# EAGLE design eagle_mini (EAGLE 7.2.0)
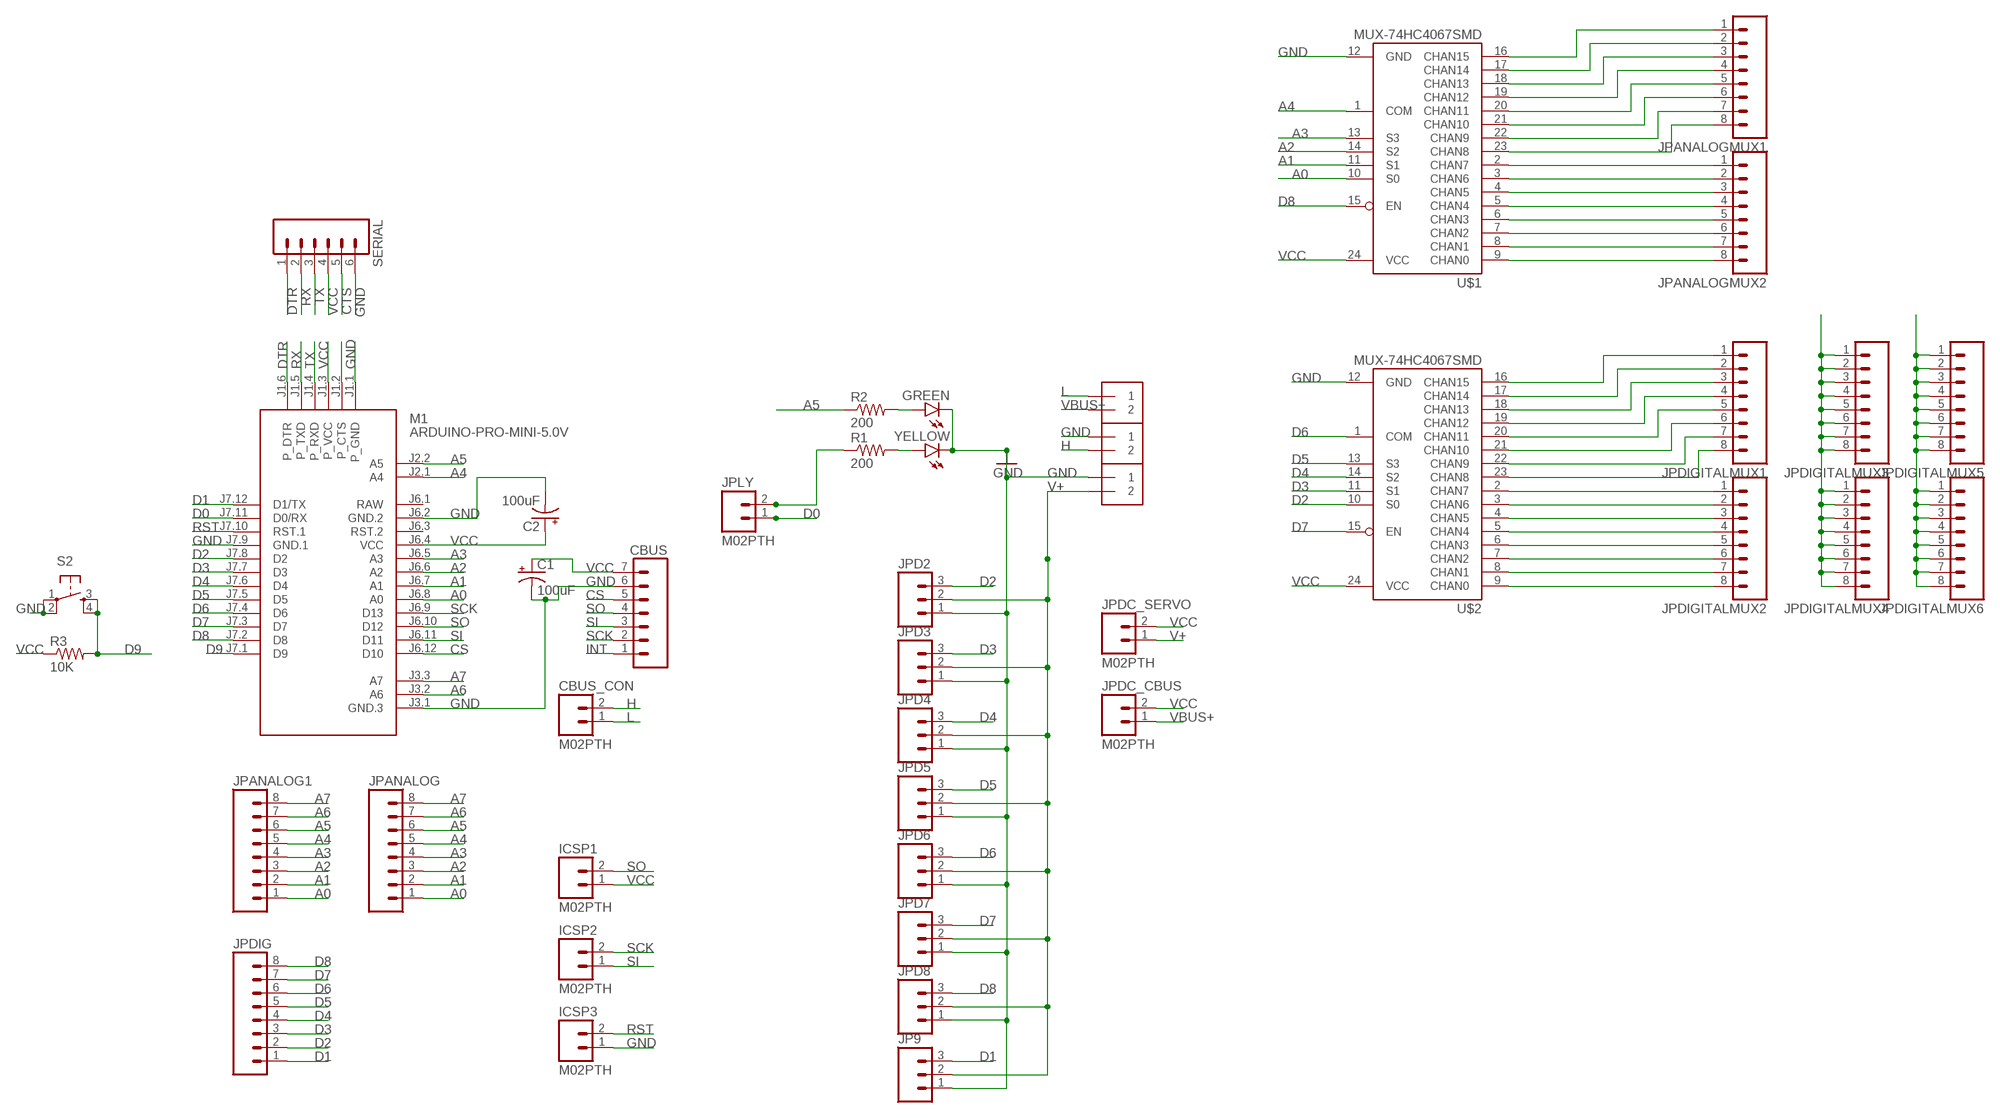
[diagram p0: schematic, sheet 1]

## Parts
C1  100uF  CPOL-USE2.5-6  [E2,5-6]
C2  100uF  CPOL-USE2.5-6  [E2,5-6]
CBUS  M07  [1X07]
CBUS_CON  M02PTH  [1X02]
EXT_VCC  1X2-3.5MM  [1X2-3.5MM]
GREEN  LED-3MM-NO_SILK  [LED3MM-NS]
ICSP1  M02PTH  [1X02]
ICSP2  M02PTH  [1X02]
ICSP3  M02PTH  [1X02]
J1  1X2-3.5MM  [1X2-3.5MM]
J2  1X2-3.5MM  [1X2-3.5MM]
JP9  M03PTH  [1X03]
JPANALOG  M08  [1X08_ROUND]
JPANALOG1  M08  [1X08_ROUND]
JPANALOGMUX1  M08  [1X08_ROUND]
JPANALOGMUX2  M08  [1X08_ROUND]
JPD2  M03PTH  [1X03]
JPD3  M03PTH  [1X03]
JPD4  M03PTH  [1X03]
JPD5  M03PTH  [1X03]
JPD6  M03PTH  [1X03]
JPD7  M03PTH  [1X03]
JPD8  M03PTH  [1X03]
JPDC_CBUS  M02PTH  [1X02]
JPDC_SERVO  M02PTH  [1X02]
JPDIG  M08  [1X08_ROUND]
JPDIGITALMUX1  M08  [1X08_ROUND]
JPDIGITALMUX2  M08  [1X08_ROUND]
JPDIGITALMUX3  M08  [1X08_ROUND]
JPDIGITALMUX4  M08  [1X08_ROUND]
JPDIGITALMUX5  M08  [1X08_ROUND]
JPDIGITALMUX6  M08  [1X08_ROUND]
JPLY  M02PTH  [1X02]
M1  ARDUINO-PRO-MINI-5.0V  [ARDUINO-PRO-MINI]
R1  200  RESISTORAXIAL-0.3  [AXIAL-0.3]
R2  200  RESISTORAXIAL-0.3  [AXIAL-0.3]
R3  10K  RESISTORAXIAL-0.3  [AXIAL-0.3]
S2  TAC_SWITCHPTH  [TACTILE-PTH]
SERIAL  M06SILK_FEMALE_PTH  [1X06]
U$1  MUX-74HC4067SMD  [SSOP24]
U$2  MUX-74HC4067SMD  [SSOP24]
YELLOW  LED-3MM-NO_SILK  [LED3MM-NS]

## Nets
6: JPDIGITALMUX2.2 U$2.3(CHAN6)
A0: JPANALOG1.1 JPANALOG.1 M1.J6.8(A0) U$1.10(S0)
A1: JPANALOG1.2 JPANALOG.2 M1.J6.7(A1) U$1.11(S1)
A2: JPANALOG1.3 JPANALOG.3 M1.J6.6(A2) U$1.14(S2)
A3: JPANALOG1.4 JPANALOG.4 M1.J6.5(A3) U$1.13(S3)
A4: JPANALOG1.5 JPANALOG.5 M1.J2.1(A4) U$1.1(COM)
A5: JPANALOG1.6 JPANALOG.6 M1.J2.2(A5) R2.P$1
A6: JPANALOG1.7 JPANALOG.7 M1.J3.2(A6)
A7: JPANALOG1.8 JPANALOG.8 M1.J3.3(A7)
CS: CBUS.5 M1.J6.12(D10)
CTS: SERIAL.5
D0: JPLY.1 M1.J7.11(D0/RX)
D1: JP9.3 JPDIG.1 M1.J7.12(D1/TX)
D2: JPD2.3 JPDIG.2 M1.J7.8(D2) U$2.10(S0)
D3: JPD3.3 JPDIG.3 M1.J7.7(D3) U$2.11(S1)
D4: JPD4.3 JPDIG.4 M1.J7.6(D4) U$2.14(S2)
D5: JPD5.3 JPDIG.5 M1.J7.5(D5) U$2.13(S3)
D6: JPD6.3 JPDIG.6 M1.J7.4(D6) U$2.1(COM)
D7: JPD7.3 JPDIG.7 M1.J7.3(D7) U$2.15(EN)
D8: JPD8.3 JPDIG.8 M1.J7.2(D8) U$1.15(EN)
D9: M1.J7.1(D9) R3.P$2 S2.3 S2.4
DTR: M1.J1.6(P_DTR) SERIAL.1
GND: C1.- C2.- CBUS.6 EXT_VCC.1 GREEN.K(C) ICSP3.1 J1.1 JP9.1 JPD2.1 JPD3.1 JPD4.1 JPD5.1 JPD6.1 JPD7.1 JPD8.1 JPDIGITALMUX3.1 JPDIGITALMUX3.2 JPDIGITALMUX3.3 JPDIGITALMUX3.4 JPDIGITALMUX3.5 JPDIGITALMUX3.6 JPDIGITALMUX3.7 JPDIGITALMUX3.8 JPDIGITALMUX4.1 JPDIGITALMUX4.2 JPDIGITALMUX4.3 JPDIGITALMUX4.4 JPDIGITALMUX4.5 JPDIGITALMUX4.6 JPDIGITALMUX4.7 JPDIGITALMUX4.8 M1.J1.1(P_GND) M1.J3.1(GND.3) M1.J6.2(GND.2) M1.J7.9(GND.1) S2.1 S2.2 SERIAL.6 U$1.12(GND) U$2.12(GND) YELLOW.K(C)
H: CBUS_CON.2 J1.2
INT: CBUS.1
L: CBUS_CON.1 J2.1
MA0: JPANALOGMUX2.8 U$1.9(CHAN0)
MA1: JPANALOGMUX2.7 U$1.8(CHAN1)
MA2: JPANALOGMUX2.6 U$1.7(CHAN2)
MA3: JPANALOGMUX2.5 U$1.6(CHAN3)
MA4: JPANALOGMUX2.4 U$1.5(CHAN4)
MA5: JPANALOGMUX2.3 U$1.4(CHAN5)
MA6: JPANALOGMUX2.2 U$1.3(CHAN6)
MA7: JPANALOGMUX2.1 U$1.2(CHAN7)
MA8: JPANALOGMUX1.8 U$1.23(CHAN8)
MA9: JPANALOGMUX1.7 U$1.22(CHAN9)
MA10: JPANALOGMUX1.6 U$1.21(CHAN10)
MA11: JPANALOGMUX1.5 U$1.20(CHAN11)
MA12: JPANALOGMUX1.4 U$1.19(CHAN12)
MA13: JPANALOGMUX1.3 U$1.18(CHAN13)
MA14: JPANALOGMUX1.2 U$1.17(CHAN14)
MA15: JPANALOGMUX1.1 U$1.16(CHAN15)
MD0: JPDIGITALMUX2.8 U$2.9(CHAN0)
MD1: JPDIGITALMUX2.7 U$2.8(CHAN1)
MD2: JPDIGITALMUX2.6 U$2.7(CHAN2)
MD3: JPDIGITALMUX2.5 U$2.6(CHAN3)
MD4: JPDIGITALMUX2.4 U$2.5(CHAN4)
MD5: JPDIGITALMUX2.3 U$2.4(CHAN5)
MD7: JPDIGITALMUX2.1 U$2.2(CHAN7)
MD8: JPDIGITALMUX1.8 U$2.23(CHAN8)
MD9: JPDIGITALMUX1.7 U$2.22(CHAN9)
MD10: JPDIGITALMUX1.6 U$2.21(CHAN10)
MD11: JPDIGITALMUX1.5 U$2.20(CHAN11)
MD12: JPDIGITALMUX1.4 U$2.19(CHAN12)
MD13: JPDIGITALMUX1.3 U$2.18(CHAN13)
MD14: JPDIGITALMUX1.2 U$2.17(CHAN14)
MD15: JPDIGITALMUX1.1 U$2.16(CHAN15)
N$6: M1.J1.2(P_CTS)
N$17: GREEN.A R2.P$2
N$18: R1.P$2 YELLOW.A
N$28: JPLY.2 R1.P$1
RST: ICSP3.2 M1.J7.10(RST.1)
RX: M1.J1.5(P_TXD) SERIAL.2
SCK: CBUS.2 ICSP2.2 M1.J6.9(D13)
SI: CBUS.3 ICSP2.1 M1.J6.11(D11)
SO: CBUS.4 ICSP1.2 M1.J6.10(D12)
TX: M1.J1.4(P_RXD) SERIAL.3
V+: EXT_VCC.2 JP9.2 JPD2.2 JPD3.2 JPD4.2 JPD5.2 JPD6.2 JPD7.2 JPD8.2 JPDC_SERVO.1 JPDIGITALMUX5.1 JPDIGITALMUX5.2 JPDIGITALMUX5.3 JPDIGITALMUX5.4 JPDIGITALMUX5.5 JPDIGITALMUX5.6 JPDIGITALMUX5.7 JPDIGITALMUX5.8 JPDIGITALMUX6.1 JPDIGITALMUX6.2 JPDIGITALMUX6.3 JPDIGITALMUX6.4 JPDIGITALMUX6.5 JPDIGITALMUX6.6 JPDIGITALMUX6.7 JPDIGITALMUX6.8
VBUS+: J2.2 JPDC_CBUS.1
VCC: C1.+ C2.+ CBUS.7 ICSP1.1 JPDC_CBUS.2 JPDC_SERVO.2 M1.J1.3(P_VCC) M1.J6.4(VCC) R3.P$1 SERIAL.4 U$1.24(VCC) U$2.24(VCC)
Unconnected: M1.J6.3(RST.2)

## Power pins joined to a net without a drawn wire
RAW: M1.J6.1(RAW)

## Library data of the parts
C1 C2 = adafruit:CPOL-US: POLARIZED CAPACITOR, American symbol
CBUS = SparkFun-Connectors:M07: Header 7 Standard 7-pin 0.1" header. Use with straight break away headers (SKU : PRT-00116), right angle break away headers (PRT-00553), swiss pins (PRT-00743), machine pins (PRT-00117), and female headers (PRT-00115). NOTES ON THE VARIANTS LOCK and LOCK_LONGPADS... This footprint was designed to help hold the alignment of a through-hole component (i.e. 7-pin header) while soldering it into place. You may notice that each hole has been shifted either up or down by 0.005 of an inch from it's more standard position (which is usually a perfectly straight line). This slight alteration caused the pins (the squares in the middle) to touch the edges of the holes. Because they are alternating, it causes a "brace" to hold the header in place. 0.005 has proven to be the perfect amount of "off-center" position when using our standard breakaway headers. Although looks a little odd when you look at the bare footprint, once you have a header in there, the alteration is very hard to notice. Also, if you push a header all the way into place, it is covered up entirely on the bottom side. This idea of altering the position of holes to aid alignment will be further integrated into the Sparkfun Library for other footprints. It can help hold any component with 3 or more connection pins.
CBUS_CON ICSP1-ICSP3 JPDC_CBUS JPDC_SERVO JPLY = SparkFun-Connectors:M02: Standard 2-pin 0.1" header. Use with - straight break away headers ( PRT-00116) - right angle break away headers (PRT-00553) - swiss pins (PRT-00743) - machine pins (PRT-00117) - female headers (PRT-00115) Molex polarized connector foot print use with: PRT-08233 with associated crimp pins and housings. 2.54_SCREWTERM for use with PRT-10571. 3.5mm Screw Terminal footprints for PRT-08084 5mm Screw Terminal footprints for use with PRT-08432
EXT_VCC J1 J2 = Arduino_merg:1X2: 3.5mm Terminal block http://www.ladyada.net/library/pcb/eaglelibrary.html
GREEN YELLOW = SparkFun-LED:LED: LEDs Standard schematic elements and footprints for 5mm, 3mm, 1206, and 0603 sized LEDs. 5mm - Spark Fun Electronics SKU : COM-00529 (and others)
JP9 JPD2-JPD8 = SparkFun-Connectors:M03: Header 3 Standard 3-pin 0.1" header. Use with straight break away headers (SKU : PRT-00116), right angle break away headers (PRT-00553), swiss pins (PRT-00743), machine pins (PRT-00117), and female headers (PRT-00115). Molex polarized connector foot print use with SKU : PRT-08232 with associated crimp pins and housings.
JPANALOG JPANALOG1 JPANALOGMUX1 JPANALOGMUX2 JPDIG JPDIGITALMUX1-JPDIGITALMUX6 = SparkFun-Connectors:M08: Header 8 Standard 8-pin 0.1" header. Use with straight break away headers (SKU : PRT-00116), right angle break away headers (PRT-00553), swiss pins (PRT-00743), machine pins (PRT-00117), and female headers (PRT-00115).
M1 = diy-modules:ARDUINO-PRO-MINI-*: Arduino Pro Mini
R1-R3 = SparkFun-Passives:RESISTOR: Resistor Basic schematic elements and footprints for 0603, 1206, and PTH resistors.
S2 = SparkFun-Retired:TAC_SWITCH: Momentary Switch Button commonly used for reset or general input. Spark Fun Electronics SKU : COM-00097 SMT- SWCH-08247
SERIAL = SparkFun-Connectors:M06: Header 6 Standard 6-pin 0.1" header. Use with straight break away headers (SKU : PRT-00116), right angle break away headers (PRT-00553), swiss pins (PRT-00743), machine pins (PRT-00117), and female headers (PRT-00115). Molex polarized connector foot print use with SKU : PRT-08094 with associated crimp pins and housings. NOTES ON THE VARIANTS LOCK and LOCK_LONGPADS... This footprint was designed to help hold the alignment of a through-hole component (i.e. 6-pin header) while soldering it into place. You may notice that each hole has been shifted either up or down by 0.005 of an inch from it's more standard position (which is a perfectly straight line). This slight alteration caused the pins (the squares in the middle) to touch the edges of the holes. Because they are alternating, it causes a "brace" to hold the component in place. 0.005 has proven to be the perfect amount of "off-center" position when using our standard breakaway headers. Although looks a little odd when you look at the bare footprint, once you have a header in there, the alteration is very hard to notice. Also,if you push a header all the way into place, it is covered up entirely on the bottom side. This idea of altering the position of holes to aid alignment will be further integrated into the Sparkfun Library for other footprints. It can help hold any component with 3 or more connection pins.; PROD_ID: CONN-08437
U$1 U$2 = SparkFun-AnalogIC:MUX-74HC4067: 16-channel analog MUX

## Board
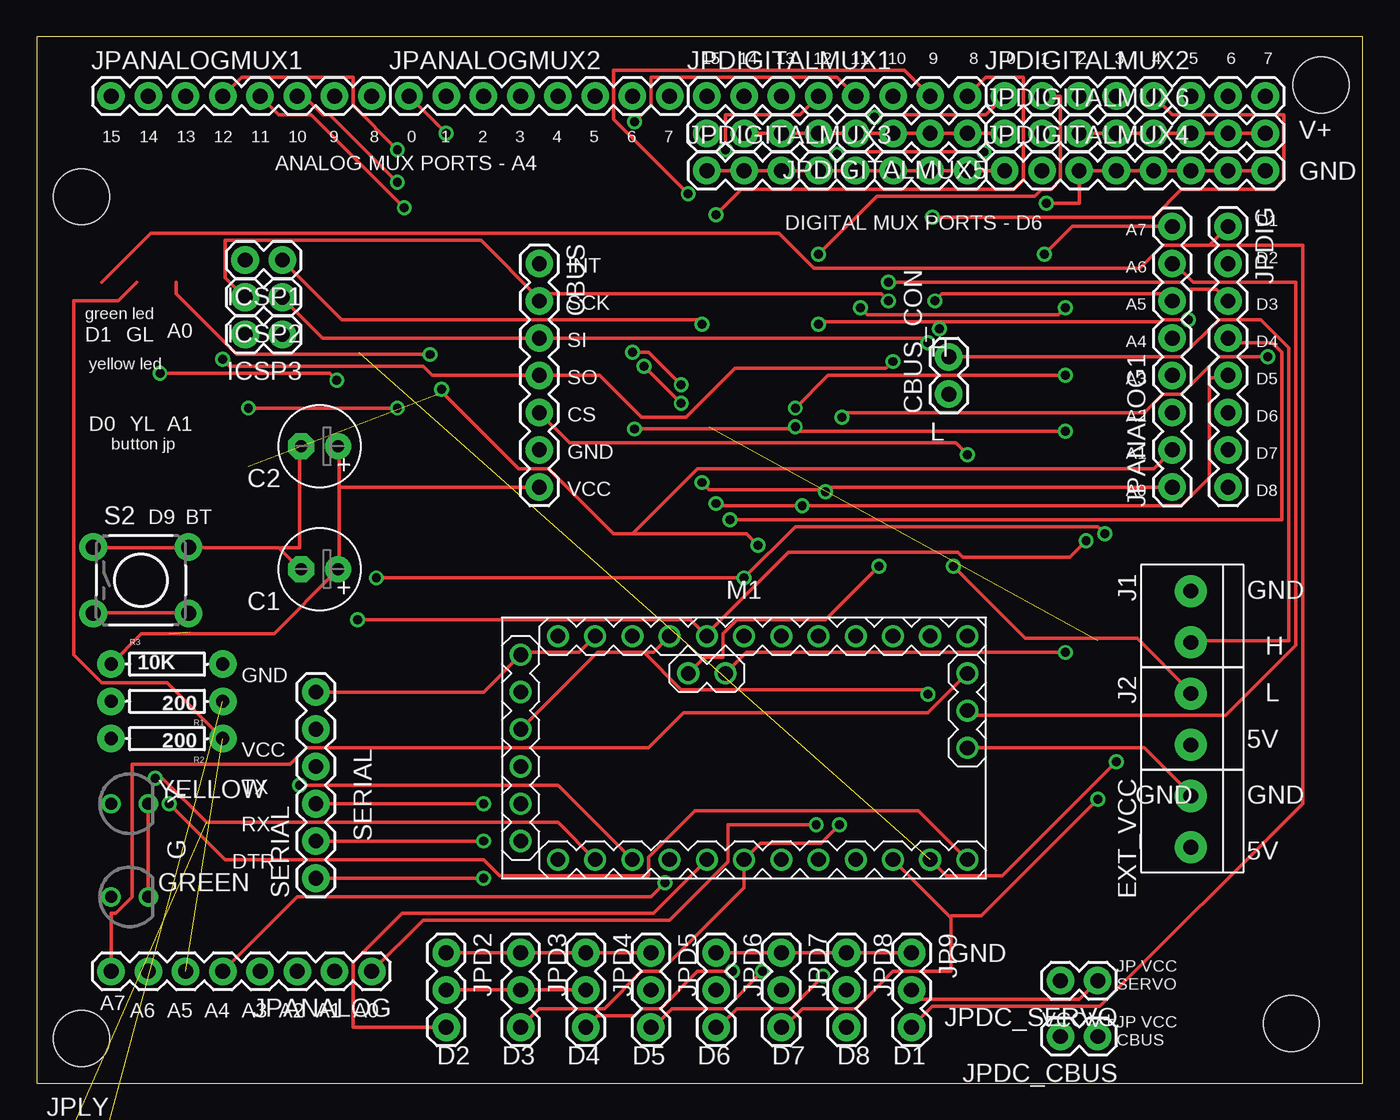
[diagram p1: board, top side]
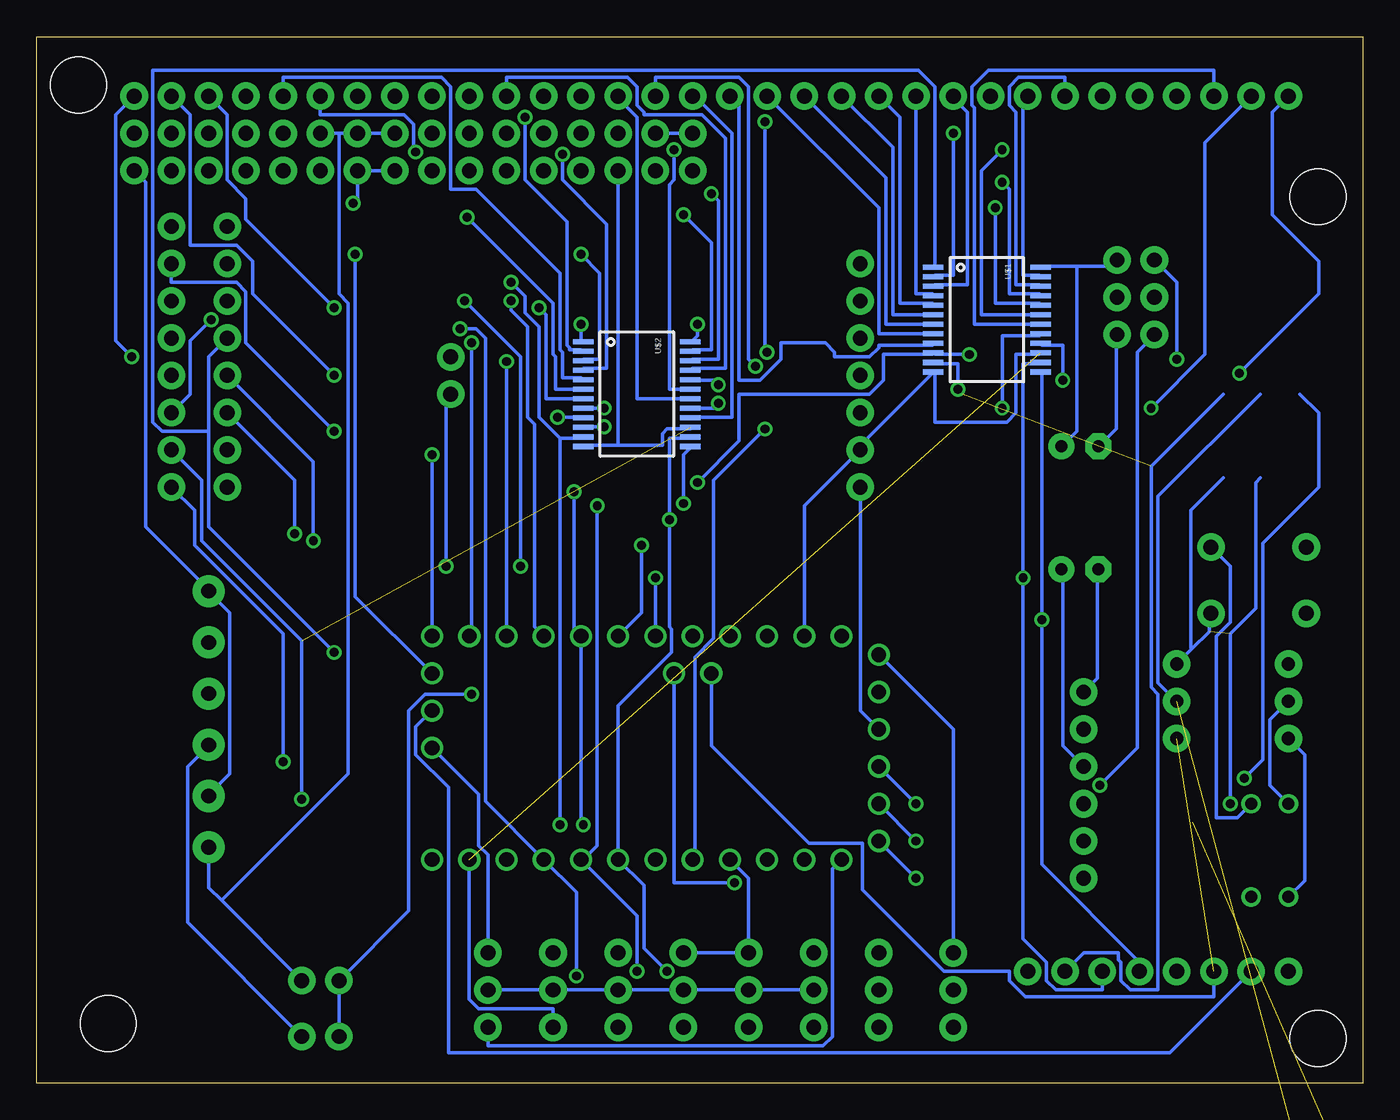
[diagram p2: board, bottom side, seen from below]

Size 90.48 x 71.36 mm. Coordinates in mm from the lower left corner, seen from the top.
Outline: 0,0 90.48,0 90.48,71.36 0,71.36 0,0
Copper layers (1*16): Top 0.035mm / dielectric 1.5mm / Bottom 0.035mm
Design rules "default": minimum track width 10mil, minimum drill 24mil, track to track 8mil, track to pad 8mil, pad to pad 8mil, via to via 8mil, smd to smd 8mil, copper to edge 40mil, drill to drill 8mil, minimum pad ring 10mil, minimum via ring 8mil, stop-mask expansion 4mil, vias tented up to drill 0mil, thermal gap 10mil
Holes 3.81 mm at 3.05,60.45 3.05,3.05 85.6,4.06 87.63,68.07

### Footprints (pad centres in the part's own frame; a part is rotated, then mirrored left to right if it is on the bottom)
E2,5-6 = drill 0.813 pad 1.778: + -1.27,0 | drill 0.813 pad 1.778 octagon: - 1.27,0
1X07 = drill 1.016 pad 1.88: 1 0,0; 2 2.54,0; 3 5.08,0; 4 7.62,0; 5 10.16,0; 6 12.7,0; 7 15.24,0
1X02 = drill 1.016 pad 1.88: 1 0,0; 2 2.54,0
1X2-3.5MM = drill 1 pad 2.184: 1 1.8,0; 2 -1.7,0
LED3MM-NS = drill 0.813: A -1.27,0; K 1.27,0
1X03 = drill 1.016 pad 1.88: 1 0,0; 2 2.54,0; 3 5.08,0
1X08_ROUND = drill 1.016 pad 1.88: 1 0,0; 2 2.54,0; 3 5.08,0; 4 7.62,0; 5 10.16,0; 6 12.7,0; 7 15.24,0; 8 17.78,0
ARDUINO-PRO-MINI = drill 1: J1.1 -15.24,6.35; J1.2 -15.24,3.81; J1.3 -15.24,1.27; J1.4 -15.24,-1.27; J1.5 -15.24,-3.81; J1.6 -15.24,-6.35; J2.1 -1.27,5.08; J2.2 -3.81,5.08; J3.1 15.24,0; J3.2 15.24,2.54; J3.3 15.24,5.08; J6.1 -12.7,7.62; J6.2 -10.16,7.62; J6.3 -7.62,7.62; J6.4 -5.08,7.62; J6.5 -2.54,7.62; J6.6 0,7.62; J6.7 2.54,7.62; J6.8 5.08,7.62; J6.9 7.62,7.62; J6.10 10.16,7.62; J6.11 12.7,7.62; J6.12 15.24,7.62; J7.1 15.24,-7.62; J7.2 12.7,-7.62; J7.3 10.16,-7.62; J7.4 7.62,-7.62; J7.5 5.08,-7.62; J7.6 2.54,-7.62; J7.7 0,-7.62; J7.8 -2.54,-7.62; J7.9 -5.08,-7.62; J7.10 -7.62,-7.62; J7.11 -10.16,-7.62; J7.12 -12.7,-7.62
AXIAL-0.3 = drill 0.9 pad 1.88: P$1 -3.81,0; P$2 3.81,0
TACTILE-PTH = drill 1.016 pad 1.88: 1 -3.251,2.261; 2 3.251,2.261; 3 -3.251,-2.261; 4 3.251,-2.261
1X06 = drill 1.016 pad 1.88: 1 0,0; 2 2.54,0; 3 5.08,0; 4 7.62,0; 5 10.16,0; 6 12.7,0
SSOP24 = smd 0.348 x 1.397: 1 -3.575,-3.656; 2 -2.925,-3.656; 3 -2.275,-3.656; 4 -1.625,-3.656; 5 -0.975,-3.656; 6 -0.325,-3.656; 7 0.325,-3.656; 8 0.975,-3.656; 9 1.625,-3.656; 10 2.275,-3.656; 11 2.925,-3.656; 12 3.575,-3.656; 13 3.575,3.656; 14 2.925,3.656; 15 2.275,3.656; 16 1.625,3.656; 17 0.975,3.656; 18 0.325,3.656; 19 -0.325,3.656; 20 -0.975,3.656; 21 -1.625,3.656; 22 -2.275,3.656; 23 -2.925,3.656; 24 -3.575,3.656

### Placement (x,y rotation side)
C1  19.3,35.05 180 top
C2  19.3,43.43 180 top
CBUS  34.29,55.88 270 top
CBUS_CON  62.23,46.99 90 top
EXT_VCC  78.74,17.78 90 top
GREEN  6.35,12.7 0 top
ICSP1  16.76,56.13 180 top
ICSP2  16.76,53.59 180 top
ICSP3  16.76,51.05 180 top
J1  78.74,31.75 90 top
J2  78.74,24.77 90 top
JP9  59.69,8.89 270 top
JPANALOG  22.86,7.62 180 top
JPANALOG1  77.47,40.64 90 top
JPANALOGMUX1  5.08,67.31 0 top
JPANALOGMUX2  25.4,67.31 0 top
JPD2  27.94,8.89 270 top
JPD3  33.02,8.89 270 top
JPD4  37.46,8.89 270 top
JPD5  41.91,8.89 270 top
JPD6  46.35,8.89 270 top
JPD7  50.8,8.89 270 top
JPD8  55.24,8.89 270 top
JPDC_CBUS  72.39,3.17 180 top
JPDC_SERVO  72.39,6.99 180 top
JPDIG  81.28,58.42 270 top
JPDIGITALMUX1  45.72,67.31 0 top
JPDIGITALMUX2  66.04,67.31 0 top
JPDIGITALMUX3  45.72,62.23 0 top
JPDIGITALMUX4  66.04,62.23 0 top
JPDIGITALMUX5  63.5,64.77 180 top
JPDIGITALMUX6  66.04,64.77 0 top
JPLY  2.03,-4.06 0 top  (outside the outline)
M1  48.26,22.86 0 top
R1  8.89,26.04 180 top
R2  8.89,23.5 180 top
R3  8.89,28.57 0 top
S2  7.11,34.29 0 top
SERIAL  19.05,13.97 90 top
U$1  25.65,52.07 270 bottom
U$2  49.53,46.99 270 bottom
YELLOW  6.35,19.05 0 top

### Tracks (layer width: path | path; a pad name or v marks a point on that pad's centre or on a via)
6  (via drill 0.61)
  Top 0.254: v53.34,56.52 57.31,60.48 68.1,60.48 68.58,60.96 69.22,60.96 69.85,61.59 69.85,67.31 JPDIGITALMUX2.2
  Bottom 0.254: v53.34,56.52 52.07,55.24 52.07,49.37 53.18,49.37 U$2.3
A0  (via drill 0.61)
  Top 0.254: v26.83,49.69 13.65,49.69 9.53,53.82 9.53,54.61 | JPANALOG1.1 54.13,40.64 v53.82,40.32 53.82,40.48 45.88,40.48 v45.4,40.96 | JPANALOG.1 26.35,11.11 43.18,11.11 47.15,15.08 47.15,17.62 v53.18,17.62
  Bottom 0.254: v26.83,49.69 29.21,49.69 U$1.10 29.37,49.69 32.7,49.69 32.7,47.94 33.66,46.99 42.55,46.99 42.55,43.81 v45.4,40.96 | v53.82,40.32 53.82,30.96 M1.J6.8 53.34,17.78 v53.18,17.62
A1  (via drill 0.61)  (1 unrouted)
  Top 0.254: 27.3,46.99 v27.62,47.31 27.62,47.15 32.86,41.91 34.92,41.91 39.37,37.47 40.64,37.47 | v49.21,36.67 48.42,37.47 40.64,37.47 | JPANALOG1.2 76.2,41.91 45.09,41.91 40.64,37.47
  Bottom 0.254: v27.62,47.31 27.62,49.05 29.21,49.05 U$1.11 | M1.J6.7 49.21,32.07 v49.21,36.67 | JPANALOG.2 19.05,8.89 16.67,8.89 16.67,8.41 16.51,8.26 16.51,6.99 15.88,6.35 13.97,6.35 13.97,26.51 14.45,26.99 14.45,42.07 9.53,46.99
A2  (via drill 0.61)
  Top 0.254: v23.18,34.45 v48.26,34.45 51.75,37.94 72.39,37.94 v72.87,37.47
  Bottom 0.254: JPANALOG.3 17.78,6.35 20.95,6.35 21.59,6.99 21.59,8.26 23.18,9.84 v23.18,34.45 23.18,49.05 22.07,49.05 U$1.14 | v48.26,34.45 M1.J6.6 | JPANALOG1.3 72.87,41.12 v72.87,37.47
A3  (via drill 0.61)
  Top 0.254: v21.91,31.59 44.61,31.59 M1.J6.5 45.72,30.64 51.28,36.2 62.87,36.2 63.18,35.88 70.48,35.88 v71.6,36.99
  Bottom 0.254: JPANALOG.4 15.24,8.26 21.91,14.92 v21.91,31.59 21.91,48.42 U$1.13 | JPANALOG1.4 71.6,42.39 v71.6,36.99
A4  (via drill 0.61)
  Top 0.254: M1.J2.1 48.42,29.37 v70.17,29.37 | JPANALOG.5 17.78,12.7 41.91,12.7 v42.86,13.65
  Bottom 0.254: 78.74,44.45 81.92,44.45 82.55,45.09 82.55,69.06 30.32,69.06 29.21,67.94 29.21,55.72 U$1.1 | 78.74,44.45 78.74,49.53 JPANALOG1.5 | v70.17,29.37 78.74,37.94 78.74,44.45 | v42.86,13.65 46.99,13.65 M1.J2.1
A5  (via drill 0.61)  (1 unrouted)
  Top 0.254: JPANALOG1.6 76.99,53.82 61.75,53.82 v61.28,53.34 | v57.47,35.24 53.82,31.59 47.78,31.59 46.83,30.64 46.83,29.05 45.56,29.05 M1.J2.2 | R2.P$1 8.89,27.3 4.45,27.3 2.54,29.21 2.54,53.34 5.56,53.34 6.83,54.61
  Bottom 0.254: M1.J2.2 44.45,23.02 37.78,16.35 34.13,16.35 34.13,13.18 28.57,7.62 24.13,7.62 24.13,6.99 23.02,5.87 10.16,5.87 JPANALOG.6 | v61.28,53.34 57.47,49.53 v57.47,35.24
A6
  Top 0.254: M1.J3.2 63.82,25.08 81.12,25.08 85.88,29.84 85.88,54.61 78.9,54.61 77.63,55.88 JPANALOG1.7
  Bottom 0.254: JPANALOG.7 13.18,2.06 62.39,2.06 62.39,20.16 64.61,22.38 64.61,24.29 M1.J3.2
A7  (via drill 0.61)
  Top 0.254: v68.74,56.52 70.64,58.42 JPANALOG1.8 | JPANALOG.8 5.08,11.59 5.4,11.59 6.51,12.7 6.51,21.75 17.3,21.75 18.41,22.86 41.75,22.86 44.13,25.24 60.8,25.24 M1.J3.3
  Bottom 0.254: M1.J3.3 68.74,33.18 v68.74,56.52
CS  (via drill 0.61)
  Top 0.254: v63.5,42.86 62.71,43.66 36.35,43.66 CBUS.5
  Bottom 0.254: v63.5,42.86 M1.J6.12
D0  (via drill 0.61)  (1 unrouted)
  Top 0.254: M1.J7.11 35.56,17.78 11.59,17.78 8.57,20.8 v8.1,20.8
  Bottom 0.254: v8.1,20.8 6.83,22.07 6.83,36.83 3.02,40.64 3.02,45.72 4.29,46.99
D1
  Top 0.254: 4.45,54.61 7.78,57.94 50.64,57.94 53.02,55.56 75.25,55.56 76.84,57.15 80.01,57.15 80.09,57.23 | JPDIG.1 80.09,57.23 | JP9.3 61.12,5.24 72.55,5.24 86.36,19.05 86.36,57.15 80.17,57.15 80.09,57.23
  Bottom 0.254: M1.J7.12 36.2,14.61 36.2,3.17 36.83,2.54 59.69,2.54 JP9.3
D2  (via drill 0.61)
  Top 0.254: M1.J7.8 42.07,11.59 24.92,11.59 21.59,8.26 21.59,3.81 JPD2.3 | v70.17,44.45 52.07,44.45 v51.75,44.77 51.75,44.61 v40.8,44.61
  Bottom 0.254: v51.75,44.77 53.18,44.77 U$2.10 | v70.17,44.45 76.2,50.48 76.2,53.98 76.84,54.61 81.28,54.61 JPDIG.2 | M1.J7.8 45.56,15.4 45.56,29.05 44.29,30.32 44.29,41.12 v40.8,44.61
D3  (via drill 0.61)
  Top 0.254: v54.77,17.62 53.5,16.35 49.37,16.35 M1.J7.7 48.26,13.34 42.55,7.62 41.27,7.62 38.73,5.08 34.29,5.08 JPD3.3 | JPDIG.3 80.49,54.13 78.58,54.13 78.11,54.61 v58.1,54.61
  Bottom 0.254: 54.77,43.97 53.34,43.97 U$2.11 | v54.77,17.62 54.77,43.97 | v58.1,54.61 57.15,53.66 57.15,52.55 56.2,51.59 56.2,45.4 54.77,43.97
D4  (via drill 0.61)
  Top 0.254: JPD4.3 38.26,4.6 40.8,4.6 41.27,5.08 42.55,5.08 45.09,7.62 v47.47,7.62 | JPDIG.4 81.6,50.48 84.3,50.48 84.93,49.85 84.93,38.42 v47.31,38.42
  Bottom 0.254: U$2.14 45.88,43.97 47.31,43.97 v47.31,38.42 47.31,31.11 47.15,30.96 47.15,29.37 50.8,25.72 M1.J7.6 49.05,13.49 49.05,9.21 v47.47,7.62
D5  (via drill 0.61)
  Top 0.254: v49.53,7.62 46.99,5.08 43.34,5.08 42.07,3.81 JPD5.3 | v46.35,39.53 46.51,39.37 v52.23,39.37 78.11,39.37 80.01,41.27 80.01,48.1 81.12,48.1 JPDIG.5
  Bottom 0.254: v49.53,7.62 49.53,11.43 M1.J7.5 53.18,15.24 52.23,16.19 v52.23,39.37 | v46.35,39.53 46.35,42.86 45.88,43.34 U$2.13
D6  (via drill 0.61)
  Top 0.254: v53.66,7.3 51.44,5.08 47.78,5.08 46.51,3.81 JPD6.3 | v53.34,51.75 53.5,51.91 61.59,51.91 | 61.59,51.91 76.68,51.91 76.84,52.07 v78.58,52.07 | 61.59,51.91 v61.59,51.44
  Bottom 0.254: v53.66,7.3 53.66,13.02 M1.J7.4 59.85,19.21 59.85,50.8 60.48,51.44 v61.59,51.44 | v53.34,51.75 53.34,50.64 U$2.1 | v78.58,52.07 80.01,50.64 80.01,46.99 JPDIG.6
D7  (via drill 0.61)  (1 unrouted)
  Top 0.254: 62.31,11.35 62.39,11.27 62.39,7.62 58.42,7.62 55.88,5.08 52.23,5.08 50.96,3.81 JPD7.3 | 62.31,11.35 M1.J7.3 | v72.39,19.37 64.45,11.43 62.39,11.43 62.31,11.35
  Bottom 0.254: JPDIG.7 79.22,41.12 79.22,36.99 72.39,30.16 v72.39,19.37
D8  (via drill 0.61)  (1 unrouted)
  Top 0.254: v73.66,21.91 65.88,14.13 62.07,14.13 M1.J7.2
  Bottom 0.254: M1.J7.2 60.96,5.71 60.32,5.08 55.24,5.08 JPD8.3 | JPDIG.8 79.69,39.05 79.69,36.67 73.66,30.64 v73.66,21.91
D9  (via drill 0.61)  (1 unrouted)
  Top 0.254: M1.J7.1 60.17,18.57 44.93,18.57 41.75,15.4 41.75,14.13 31.59,14.13 30.48,15.24 12.86,15.24 v9.05,19.05 | S2.3 3.97,32.07 10.32,32.07 S2.4
  Bottom 0.254: v9.05,19.05 9.05,30.64 7.3,32.38 7.3,40.96 6.99,41.27 | 11.67,29.61 10.48,30.8 10.48,31.91 S2.4 | 11.67,29.61 R3.P$2 | 9.53,41.27 11.75,39.05 11.75,29.69 11.67,29.61
DTR  (via drill 0.61)
  Top 0.254: SERIAL.1 v30.48,13.97
  Bottom 0.254: v30.48,13.97 M1.J1.6
GND  (via drill 0.61)
  Top 0.254: M1.J6.2 36.99,29.37 33.18,29.37 M1.J1.1 30.48,26.67 SERIAL.6 | YELLOW.K GREEN.K | 16.59,36.43 16.51,36.51 10.48,36.51 S2.2 10.32,36.51 3.97,36.51 S2.1 | 16.59,36.43 17.94,35.08 C1.- | C2.- 17.94,43.34 17.94,36.51 16.67,36.51 16.59,36.43 | JPDIGITALMUX4.8 JPDIGITALMUX4.7 JPDIGITALMUX4.6 JPDIGITALMUX4.5 JPDIGITALMUX4.4 JPDIGITALMUX4.3 71.12,60.01 v68.9,60.01 | JPDIGITALMUX3.1 JPDIGITALMUX3.2 JPDIGITALMUX3.3 JPDIGITALMUX3.4 JPDIGITALMUX3.5 JPDIGITALMUX3.6 JPDIGITALMUX3.7 JPDIGITALMUX3.8 JPDIGITALMUX4.1 | JPD2.1 JPD3.1 JPD4.1 JPD5.1 | JPD6.1 JPD7.1 JPD8.1 JP9.1 | M1.J3.1 75.57,22.86 78.74,19.68 EXT_VCC.1
  Bottom 0.254: 22.07,49.69 23.65,49.69 23.65,45.72 24.29,45.09 29.21,45.09 29.21,48.42 U$1.12 29.37,48.42 34.29,43.5 CBUS.6 38.1,39.37 M1.J6.2 | C2.- 17.94,43.5 16.83,44.61 16.83,50.96 ICSP3.1 | SERIAL.6 18.1,27.62 18.1,34.92 C1.- | YELLOW.K 8.57,18.1 10,18.1 10,30.48 9.05,31.43 9.05,35.24 10.32,36.51 S2.2 | 50.8,43.5 47.78,43.5 47.78,44.29 47.47,44.61 45.88,44.61 | 50.8,43.5 53.18,43.5 U$2.12 | JPDIGITALMUX4.1 JPDIGITALMUX4.2 68.58,60.33 v68.9,60.01 | JPDIGITALMUX3.3 50.8,43.5 | M1.J7.9 41.91,13.97 JPD5.1 JPD6.1 | M1.J3.1 60.32,19.68 60.32,16.19 59.69,15.56 JP9.1 | EXT_VCC.1 78.74,19.68 77.31,21.11 77.31,32.07 78.74,33.5 J1.1 78.74,33.66 83.03,37.94 83.03,61.44 JPDIGITALMUX4.8 | M1.J1.1 27.94,24.13 JPD2.1
H
  Top 0.254: CBUS_CON.2 78.11,49.53 80.65,52.07 83.5,52.07 85.41,50.16 85.41,30.16 78.74,30.16 J1.2
L  (via drill 0.61)
  Top 0.254: v62.55,35.24 67.47,30.32 75.09,30.32 78.74,26.67 J2.1
  Bottom 0.254: CBUS_CON.1 62.55,46.67 v62.55,35.24
MA0
  Bottom 0.254: JPANALOGMUX2.8 42.55,66.67 42.55,47.94 41.12,47.94 39.69,49.37 39.69,50.48 36.67,50.48 36.04,49.85 36.04,49.53 33.66,49.53 33.02,50.16 33.02,50.32 29.37,50.32 U$1.9
MA1
  Bottom 0.254: JPANALOGMUX2.7 33.02,59.69 33.02,51.12 29.37,51.12 U$1.8
MA2
  Bottom 0.254: JPANALOGMUX2.6 32.54,61.75 32.54,51.75 29.37,51.75 U$1.7
MA3
  Bottom 0.254: JPANALOGMUX2.5 32.07,63.82 32.07,52.39 29.37,52.39 U$1.6
MA4
  Bottom 0.254: JPANALOGMUX2.4 31.59,65.88 31.59,53.18 29.37,53.18 U$1.5
MA5
  Bottom 0.254: JPANALOGMUX2.3 30.48,53.82 29.37,53.82 U$1.4
MA6
  Bottom 0.254: JPANALOGMUX2.2 27.94,67.15 26.99,66.2 26.99,54.45 29.21,54.45 U$1.3
MA7  (via drill 0.61)
  Top 0.254: JPANALOGMUX2.1 v27.94,64.77
  Bottom 0.254: v27.94,64.77 27.94,55.09 29.21,55.09 U$1.2
MA8
  Bottom 0.254: JPANALOGMUX1.8 23.18,66.99 23.18,55.09 22.07,55.09 U$1.23
MA9
  Bottom 0.254: JPANALOGMUX1.7 20.32,68.58 23.49,68.58 24.13,67.94 24.13,66.67 23.65,66.2 23.65,54.45 22.07,54.45 U$1.22
MA10  (via drill 0.61)
  Top 0.254: v24.61,61.44 20,66.04 19.53,66.04 18.26,67.31 JPANALOGMUX1.6
  Bottom 0.254: v24.61,61.44 24.13,60.96 24.13,53.82 22.07,53.82 U$1.21
MA11  (via drill 0.61)
  Top 0.254: v25.08,59.69 18.73,66.04 16.51,66.04 JPANALOGMUX1.5
  Bottom 0.254: v25.08,59.69 25.08,53.18 22.07,53.18 U$1.20
MA12  (via drill 0.61)
  Top 0.254: v24.61,63.66 21.59,66.67 21.59,68.58 13.97,68.58 JPANALOGMUX1.4
  Bottom 0.254: v24.61,63.66 26.04,62.23 26.04,52.39 22.07,52.39 U$1.19
MA13
  Bottom 0.254: JPANALOGMUX1.3 10.16,69.06 25.56,69.06 26.67,67.94 26.67,66.67 26.51,66.52 26.51,51.75 22.07,51.75 U$1.18
MA14  (via drill 0.61)
  Top 0.254: v14.45,46.04 v24.61,46.04
  Bottom 0.254: v24.61,46.04 24.61,50.96 22.07,50.96 U$1.17 | v14.45,46.04 10.8,49.69 10.8,64.14 JPANALOGMUX1.2
MA15  (via drill 0.61)
  Top 0.254: v20.48,47.94 20,48.42 v8.41,48.42
  Bottom 0.254: v20.48,47.94 20.48,50.32 21.91,50.32 U$1.16 | v8.41,48.42 3.02,53.82 3.02,56.04 6.19,59.21 6.19,66.2 JPANALOGMUX1.1
MD0  (via drill 0.61)
  Top 0.254: v54.93,45.4 55.24,45.72 75.57,45.72 76.84,46.99 78.11,46.99 80.65,49.53 v83.98,49.53
  Bottom 0.254: v54.93,45.4 53.34,45.4 U$2.9 | v83.98,49.53 85.09,50.64 85.09,66.04 JPDIGITALMUX2.8
MD1  (via drill 0.61)
  Top 0.254: v51.75,46.04 53.98,48.26 v70.17,48.26
  Bottom 0.254: v51.75,46.04 53.18,46.04 U$2.8 | v70.17,48.26 75.72,53.82 75.72,56.04 76.84,57.15 80.01,57.15 80.01,66.04 JPDIGITALMUX2.7
MD2  (via drill 0.61)
  Top 0.254: v56.2,52.86 56.67,52.39 69.69,52.39 v70.17,52.86
  Bottom 0.254: v56.2,52.86 55.72,52.39 55.72,46.67 53.34,46.67 U$2.7 | v70.17,52.86 76.2,58.9 76.2,60.33 77.47,61.59 77.47,66.04 JPDIGITALMUX2.6
MD3  (via drill 0.61)
  Top 0.254: v61.12,59.05 76.2,59.05 78.11,60.96 84.46,60.96 85.09,61.59 85.09,66.04 77.47,66.04 JPDIGITALMUX2.5
  Bottom 0.254: v61.12,59.05 55.24,53.18 55.24,49.69 55.09,49.53 55.09,47.31 53.34,47.31 U$2.6
MD4
  Bottom 0.254: JPDIGITALMUX2.4 73.66,68.58 62.87,68.58 62.23,67.94 62.23,60.96 60.48,60.96 54.77,55.24 54.77,50.01 54.61,49.85 54.61,48.1 53.34,48.1 U$2.5
MD5  (via drill 0.61)
  Top 0.254: v54.61,63.34 54.77,63.5 v64.61,63.5
  Bottom 0.254: v54.61,63.34 54.61,61.59 51.59,58.58 51.59,48.74 53.18,48.74 U$2.4 | v64.61,63.5 64.77,63.66 64.77,65.41 65.41,66.04 71.12,66.04 JPDIGITALMUX2.3
MD7  (via drill 0.61)
  Top 0.254: v57.15,65.88 57.31,66.04 64.77,66.04 JPDIGITALMUX2.1
  Bottom 0.254: v57.15,65.88 57.15,61.59 54.29,58.74 54.29,50.32 54.13,50.16 54.13,50.01 53.34,50.01 U$2.2
MD8  (via drill 0.61)
  Top 0.254: v46.35,59.21 48.1,60.96 66.68,60.96 67.31,61.59 67.31,68.58 64.77,68.58 JPDIGITALMUX1.8
  Bottom 0.254: v46.35,59.21 44.45,57.31 44.45,50.01 45.72,50.01 U$2.23
MD9  (via drill 0.61)
  Top 0.254: v44.45,60.64 39.37,65.72 39.37,69.06 59.21,69.06 JPDIGITALMUX1.7
  Bottom 0.254: v44.45,60.64 43.97,60.17 43.97,49.37 45.72,49.37 U$2.22
MD10
  Bottom 0.254: JPDIGITALMUX1.6 58.42,68.58 50.16,68.58 49.53,67.94 49.53,66.67 49.05,66.2 49.05,66.04 45.09,66.04 43.5,64.45 43.5,48.74 45.72,48.74 U$2.21
MD11  (via drill 0.61)
  Top 0.254: v43.97,47.62 41.75,49.85 v40.64,49.85 | v40.8,65.56 41.91,66.67 41.91,68.58 54.61,68.58 JPDIGITALMUX1.5
  Bottom 0.254: v43.97,47.62 43.97,47.94 45.72,47.94 U$2.20 | v40.64,49.85 40.8,50.01 v40.8,65.56
MD12  (via drill 0.61)
  Top 0.254: v46.99,63.66 46.99,66.04 52.07,66.04 JPDIGITALMUX1.4
  Bottom 0.254: v46.99,63.66 46.99,61.59 47.31,61.28 47.31,47.31 45.88,47.31 U$2.19
MD13
  Bottom 0.254: JPDIGITALMUX1.3 50.8,67.15 49.53,65.88 49.53,46.67 45.88,46.67 U$2.18
MD14  (via drill 0.61)
  Top 0.254: v41.43,48.9 v43.97,46.35
  Bottom 0.254: v43.97,46.35 43.97,46.04 45.72,46.04 U$2.17 | v41.43,48.9 41.91,49.37 41.91,67.94 42.55,68.58 48.26,68.58 JPDIGITALMUX1.2
MD15
  Bottom 0.254: JPDIGITALMUX1.1 45.56,67.31 43.02,64.77 43.02,45.4 45.72,45.4 U$2.16
N$17
  Bottom 0.254: GREEN.A 3.97,13.81 3.97,22.38 R2.P$2
N$18
  Bottom 0.254: YELLOW.A 6.35,20.32 6.35,24.77 R1.P$2
N$28  (1 unrouted)
  Bottom 0.254: R1.P$1 13.97,27.3 13.97,40.01 6.99,46.99
RST  (via drill 0.61)
  Top 0.254: M1.J7.10 35.56,20.32 v17.94,20.32
  Bottom 0.254: v17.94,20.32 15.4,22.86 15.4,49.85 14.29,50.96 ICSP3.2
RX  (via drill 0.61)
  Top 0.254: SERIAL.2 v30.48,16.51
  Bottom 0.254: v30.48,16.51 M1.J1.5
SCK  (via drill 0.61)
  Top 0.254: v58.1,53.34 57.63,53.82 34.77,53.82 CBUS.2 34.29,53.5 30.32,57.47 12.86,57.47 12.86,54.93 14.13,53.66 ICSP2.2
  Bottom 0.254: M1.J6.9 56.52,31.11 56.52,44.93 56.99,45.4 56.99,51.59 58.1,52.7 v58.1,53.34
SI  (via drill 0.61)
  Top 0.254: v60.8,50.48 60.48,50.8 CBUS.3 19.53,50.8 16.83,53.5 ICSP2.1
  Bottom 0.254: M1.J6.11 60.8,30.64 v60.8,50.48
SO  (via drill 0.61)
  Top 0.254: v58.42,49.21 57.94,48.74 47.62,48.74 44.29,45.4 41.27,45.4 38.42,48.26 CBUS.4 26.99,48.26 26.35,48.9 13.18,48.9 v12.7,49.37
  Bottom 0.254: v58.42,49.21 M1.J6.10 | ICSP1.2 12.7,54.61 v12.7,49.37
TX  (via drill 0.61)
  Top 0.254: SERIAL.3 v30.48,19.05
  Bottom 0.254: v30.48,19.05 M1.J1.4
V+
  Top 0.254: JPDIGITALMUX6.3 JPDIGITALMUX6.4 JPDIGITALMUX6.5 JPDIGITALMUX6.6 JPDIGITALMUX6.7 JPDIGITALMUX6.8 | JPDIGITALMUX5.7 JPDIGITALMUX5.6 JPDIGITALMUX5.5 JPDIGITALMUX5.4 JPDIGITALMUX5.3 JPDIGITALMUX5.2 JPDIGITALMUX5.1 JPDIGITALMUX6.1 | JPD2.2 JPD3.2 JPD4.2 | JPDC_SERVO.1 71.12,5.71 60.32,5.71 JP9.2
  Bottom 0.254: JPDIGITALMUX5.7 JPDIGITALMUX5.8 | JPDIGITALMUX6.1 JPDIGITALMUX6.2 69.85,64.77 | 69.85,64.77 JPDIGITALMUX6.3 | 77.87,12.46 78.74,13.34 EXT_VCC.2 | 77.87,12.46 JPDC_SERVO.1 | JPD4.2 JPD5.2 JPD6.2 JPD7.2 JPD8.2 JP9.2 | 69.85,64.77 69.85,53.82 69.22,53.18 69.22,21.11 77.87,12.46
VBUS+
  Bottom 0.254: JPDC_CBUS.1 80.17,10.95 80.17,21.59 78.74,23.02 J2.2
VCC  (via drill 0.61)
  Top 0.254: M1.J1.3 38.26,29.37 41.43,29.37 | 41.43,29.37 42.07,29.37 M1.J6.4 | v60.8,26.51 60.48,26.83 43.97,26.83 41.43,29.37 | v45.4,51.75 45.09,52.07 20.8,52.07 16.83,56.04 ICSP1.1 | 20.64,40.64 20.64,43.34 C2.+ | 20.64,40.64 20.64,35.08 C1.+ 20.48,34.92 16.19,30.64 7.14,30.64 R3.P$1 | 20.64,40.64 CBUS.7
  Bottom 0.254: JPDC_CBUS.2 JPDC_SERVO.2 65.09,11.75 65.09,25.4 63.98,26.51 v60.8,26.51 | v45.4,51.75 45.4,50.96 45.72,50.64 U$2.24 | 19.53,55.72 16.83,55.72 16.83,56.04 ICSP1.1 | 19.53,55.72 21.91,55.72 U$1.24 | SERIAL.4 20.48,23.02 20.48,34.92 C1.+ | 19.53,55.72 19.53,44.45 20.48,43.5 C2.+ | M1.J1.3 34.29,25.4 CBUS.7

### Text on the board
_tsilk: 15 | 14 | 13 | 12 | 11 | 10 | 9 | 8 | 0 | 1 | 2 | 3 | 4 | 5 | 6 | 7 | 15 | 14 | 13 | 12 | 11 | 10 | 9 | 8 | 0 | 1 | 2 | 3 | 4 | 5 | 6 | 7 | V+ | ANALOG MUX PORTS - A4 | GND | DIGITAL MUX PORTS - D6 | A7 | D1 | D2 | INT | A6 | SCK | A5 | D3 | green led | D1 | GL | A0 | SI | H | A4 | D4 | yellow led | SO | A3 | D5 | CS | A2 | D6 | D0 | YL | A1 | L | button jp | GND | A1 | D7 | VCC | A0 | D8 | D9 | BT | GND | H | GND | L | 5V | VCC | TX | Y | GND | GND | RX | SERIAL | G | DTR | 5V | GND | JP VCC / SERVO | A7 | A6 | A5 | A4 | A3 | A2 | A1 | A0 | VCC | V+ | JP VCC / CBUS | D2 | D3 | D4 | D5 | D6 | D7 | D8 | D1